# Altium schematic sheet AMS1117-3.3_C3472221_AMS1117-3.3_C347222.schdoc.schdoc
size 124 x 99 mm
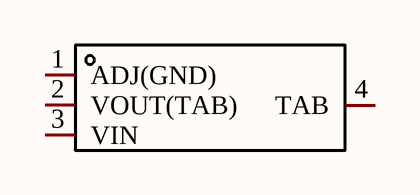
[diagram p0: AMS1117-3.3_C3472221_AMS1117-3.3_C347222.schdoc.schdoc]

## Parts
U?  AMS1117-3.3_C347222  [SOT-223-4_L6.5-W3.5-P2.30-LS7.0-BR]  (value not drawn)

## Nets

Not connected (* = marked no-connect by the designer): U? 1(ADJ(GND)) 2(VOUT(TAB)) 3(VIN) 4(TAB)

## Library data of the parts
U? = AMS1117-3.3_C347222: Manufacturer: UMW(友台半导体); Add into BOM: yes; Output Type: 固定; Maximum Input Voltage: 18V; Output Voltage: 3.3V; Output Current: 1A; Power Supply Rejection Ratio (PSRR): 60dB@(120Hz); Dropout Voltage: 1.3V@(1A); Output Polarity: 正; Number of Outputs: 1; Symbol: AMS1117-3.3_C347222; Device: AMS1117-3.3_C347222; Supplier: LCSC; Supplier Part: C347222; Manufacturer Part: AMS1117-3.3; JLCPCB Part Class: Extended Part; LCSC Part Name: 输入18V 输出3.3V 1A; Supplier Footprint: SOT-223; Datasheet: https://atta.szlcsc.com/upload/public/pdf/source/20231109/155D79A26D9DB04352555A58D5969DC8.pdf; Convert to PCB: yes